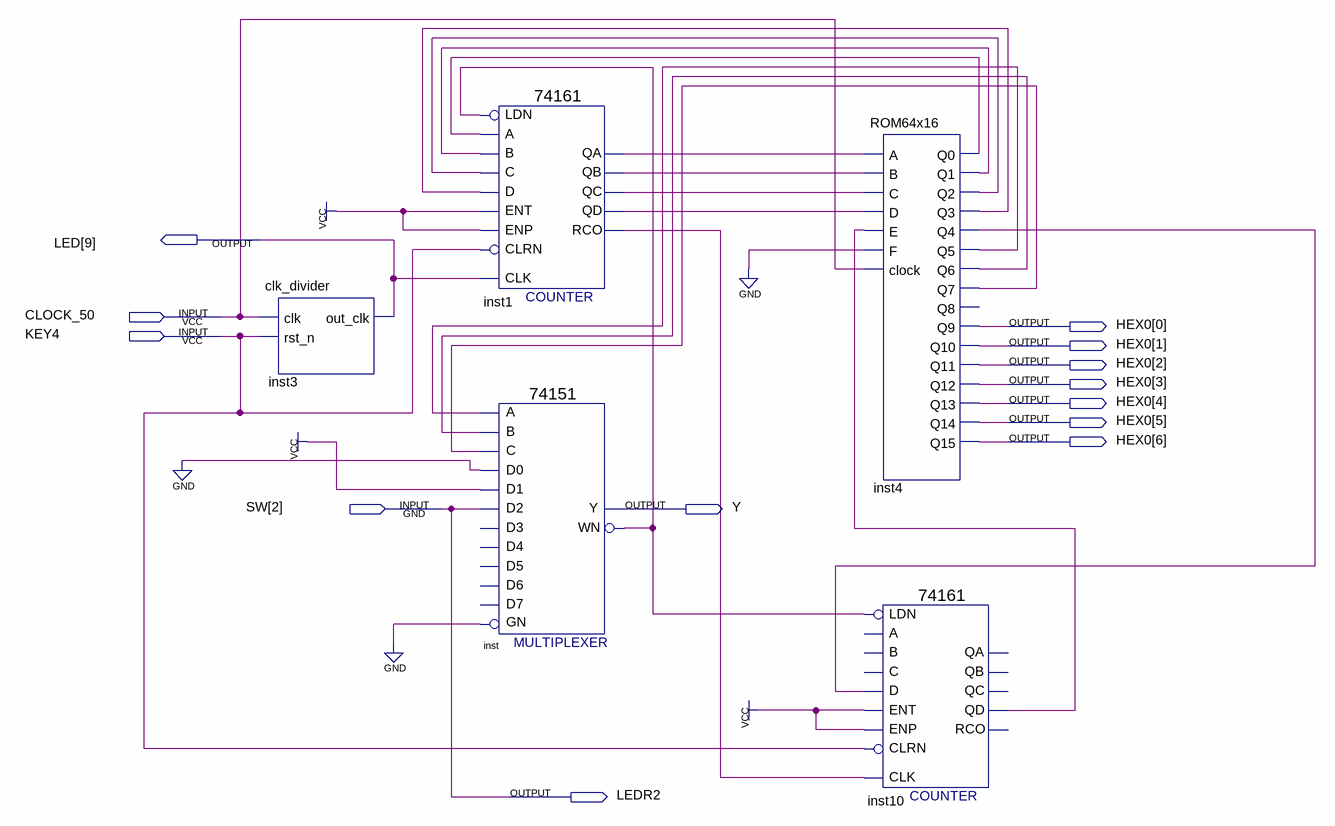
[diagram p0: schematic sheet]
// Quartus schematic PSM.bdf as structural Verilog: 5 symbols, 13 pins
module PSM (
  input  CLOCK_50,
  input  KEY4,
  input  [2:2] SW,
  output [9:9] LED,
  output [6:0] HEX0,
  output Y,
  output LEDR2
);

  wire inst1_qa, inst1_qb, inst1_qc, inst1_qd, inst1_rco, inst4_q0, inst4_q1, inst4_q2, inst4_q3, inst4_q4,
       inst4_q5, inst4_q6, inst4_q7, inst10_qd, inst_wn;

  clk_divider inst3 (.clk(CLOCK_50), .rst_n(KEY4), .out_clk(LED[9]));
  \74161  inst1 (
    .CLRN(KEY4), .CLK(LED[9]), .ENP(1'b1), .LDN(inst_wn), .A(inst4_q0), .D(inst4_q3), .ENT(1'b1),
    .B(inst4_q1), .C(inst4_q2), .QD(inst1_qd), .QC(inst1_qc), .QB(inst1_qb), .QA(inst1_qa), .RCO(inst1_rco));
  \74151  inst (
    .GN(1'b0), .C(inst4_q7), .B(inst4_q6), .A(inst4_q5), .D0(1'b0), .D1(1'b1), .D2(SW[2]), .Y(Y), .WN(inst_wn));  // open: D5, D4, D3, D6, D7
  ROM64x16 inst4 (
    .A(inst1_qa), .B(inst1_qb), .C(inst1_qc), .D(inst1_qd), .E(inst10_qd), .F(1'b0), .clock(CLOCK_50),
    .Q0(inst4_q0), .Q1(inst4_q1), .Q2(inst4_q2), .Q3(inst4_q3), .Q4(inst4_q4), .Q5(inst4_q5), .Q6(inst4_q6),
    .Q7(inst4_q7), .Q9(HEX0[0]), .Q10(HEX0[1]), .Q11(HEX0[2]), .Q12(HEX0[3]), .Q13(HEX0[4]), .Q14(HEX0[5]),
    .Q15(HEX0[6]));  // open: Q8
  \74161  inst10 (
    .CLRN(KEY4), .CLK(inst1_rco), .ENP(1'b1), .LDN(inst_wn), .D(inst4_q4), .ENT(1'b1), .QD(inst10_qd));  // open: A, B, C, QC, QB, QA, RCO

  assign LEDR2 = SW[2];
endmodule
